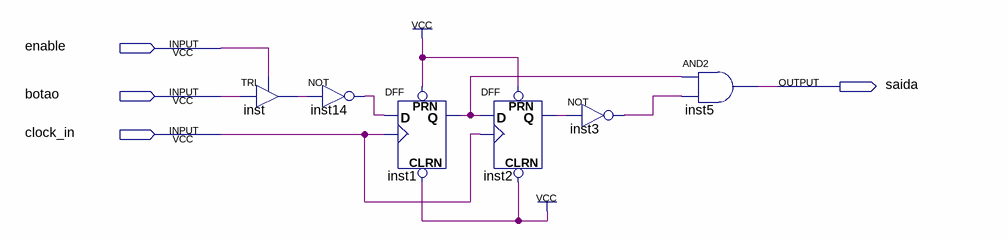
[diagram p0: schematic sheet]
// Quartus schematic debounce.bdf as structural Verilog: 6 symbols, 4 pins
module debounce (
  input  enable,
  input  botao,
  input  clock_in,
  output saida
);

  wire inst1_q, inst2_q, inst3_out, inst14_out, inst_out;

  TRI inst (.IN(botao), .OE(enable), .OUT(inst_out));
  not inst14 (inst14_out, inst_out);
  DFF inst1 (.CLRN(1'b1), .CLK(clock_in), .D(inst14_out), .PRN(1'b1), .Q(inst1_q));
  DFF inst2 (.CLRN(1'b1), .CLK(clock_in), .D(inst1_q), .PRN(1'b1), .Q(inst2_q));
  not inst3 (inst3_out, inst2_q);
  and inst5 (saida, inst1_q, inst3_out);
endmodule
